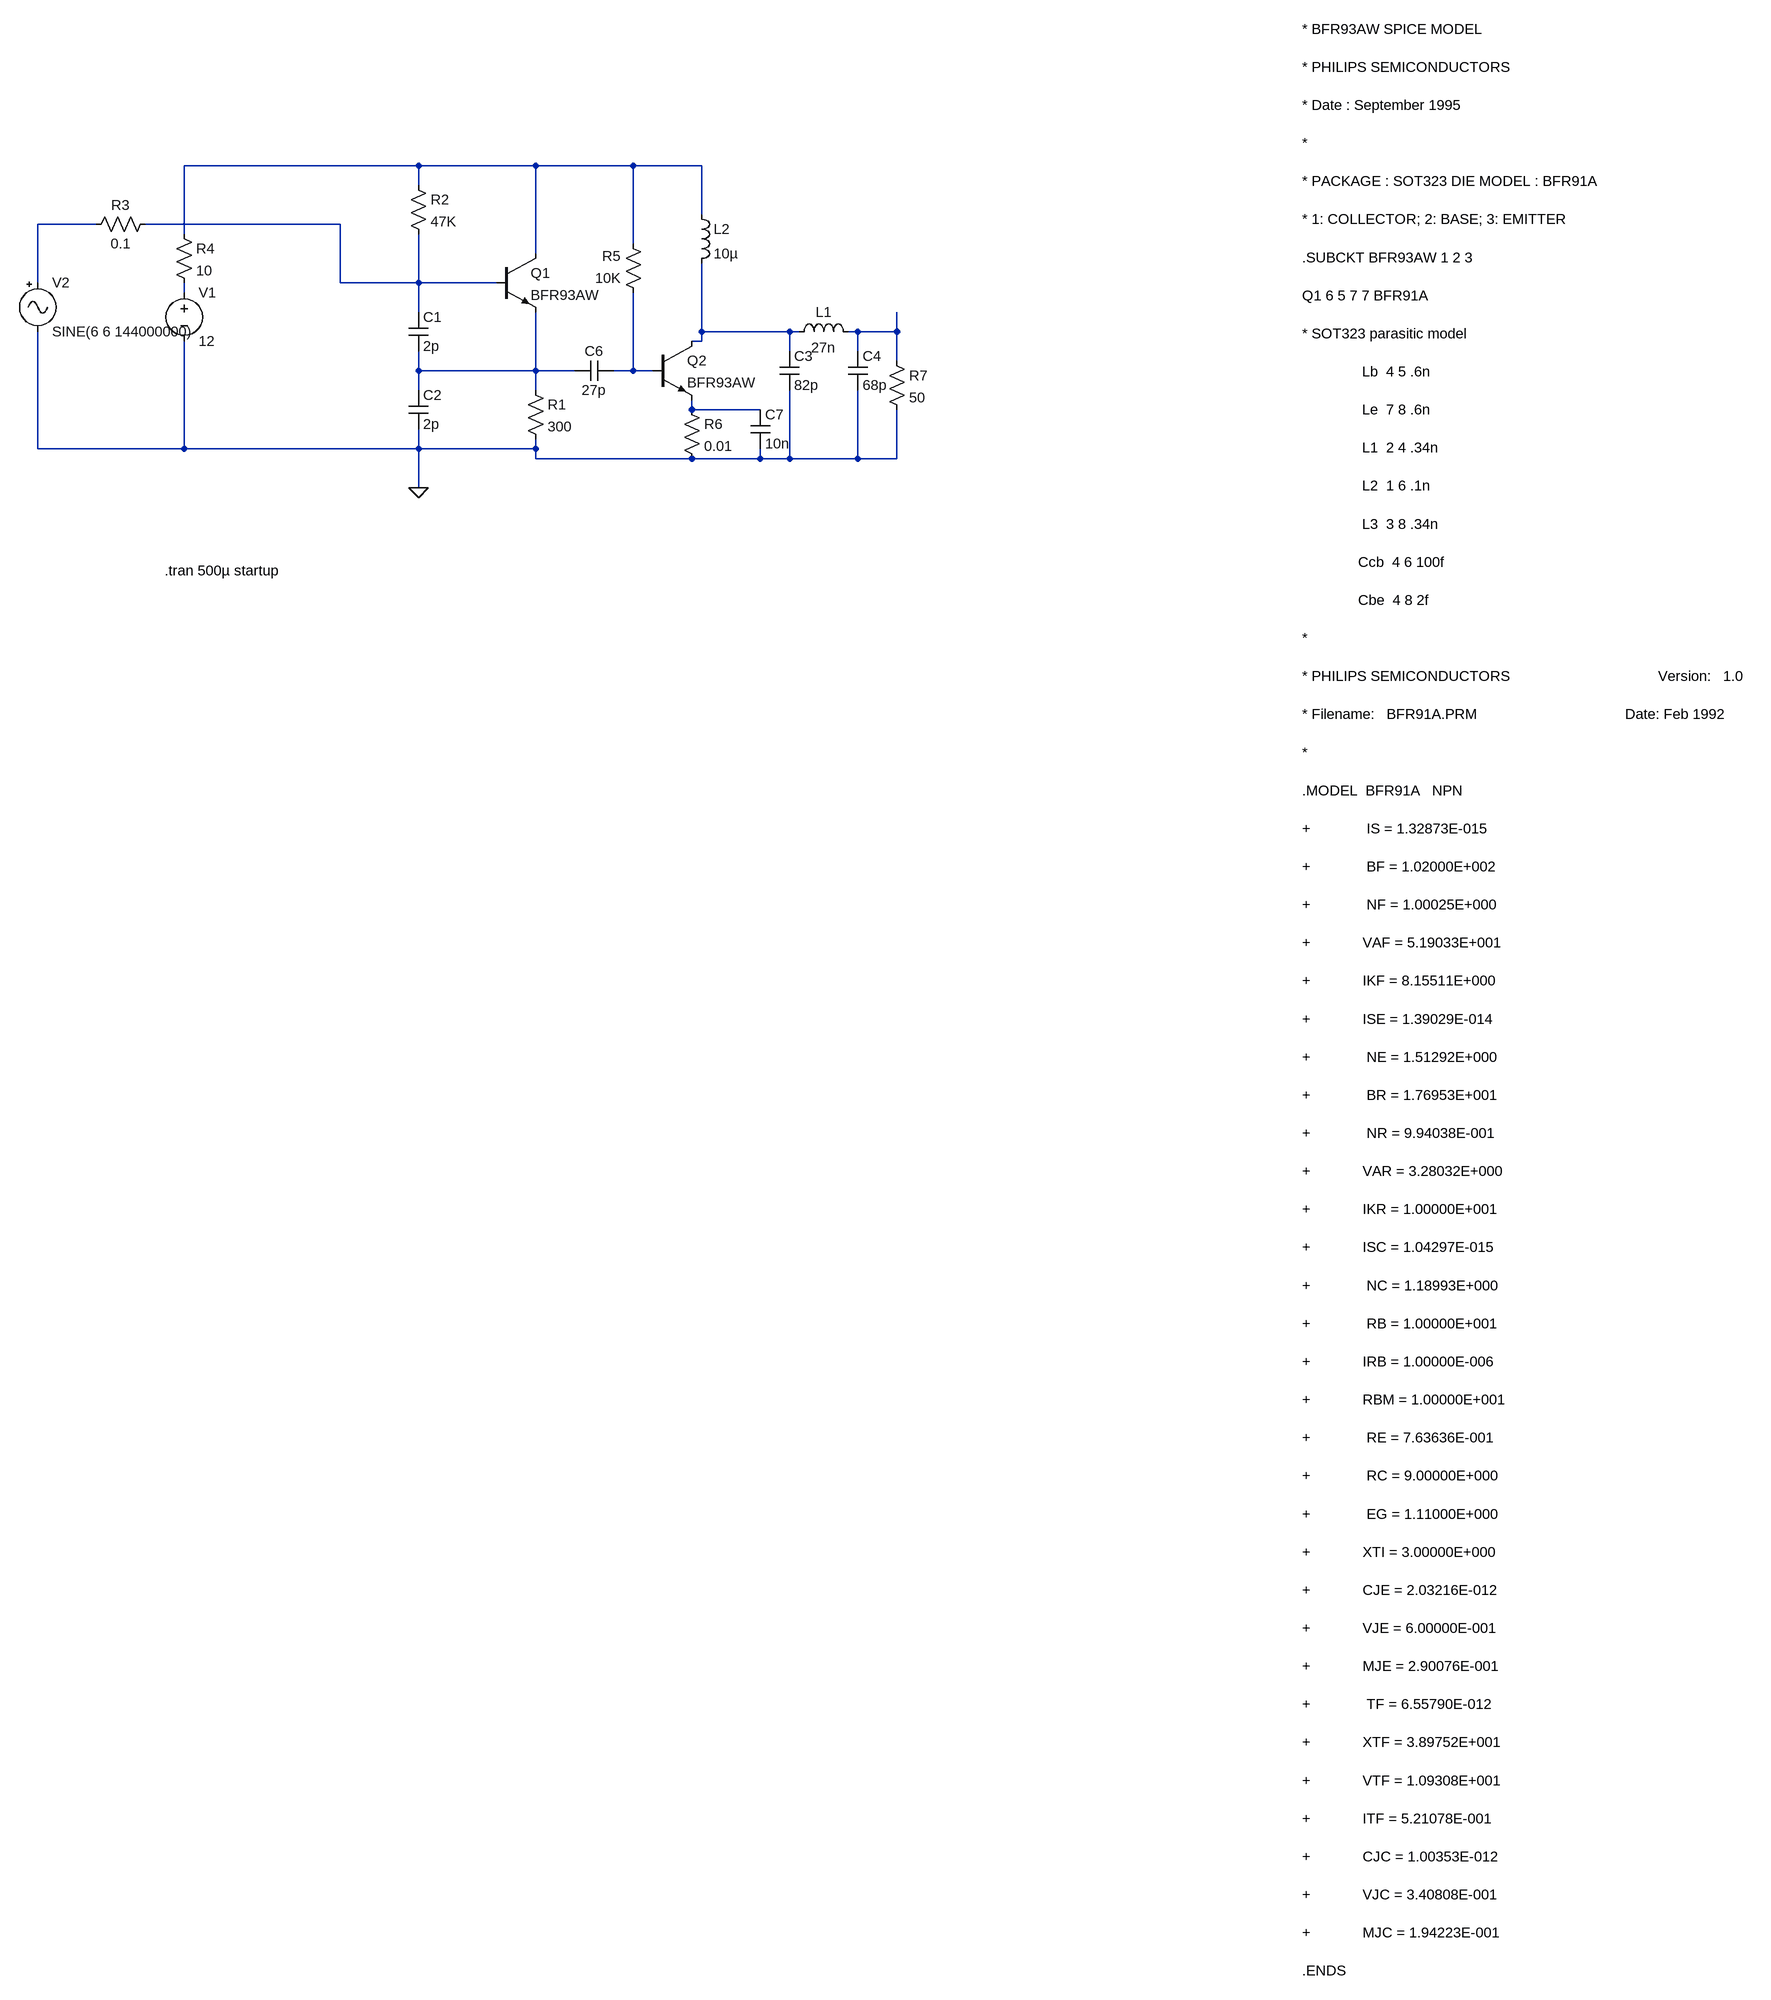
[diagram p0: schematic tx.asc]
tx.asc, the LTspice schematic file:
Version 4
SHEET 1 2536 820
WIRE 240 -688 -144 -688
WIRE 432 -688 240 -688
WIRE 592 -688 432 -688
WIRE 704 -688 592 -688
WIRE 240 -656 240 -688
WIRE 704 -608 704 -688
WIRE -288 -592 -384 -592
WIRE 112 -592 -208 -592
WIRE -144 -576 -144 -688
WIRE 592 -560 592 -688
WIRE 432 -544 432 -688
WIRE -384 -496 -384 -592
WIRE 112 -496 112 -592
WIRE 240 -496 240 -576
WIRE 240 -496 112 -496
WIRE 368 -496 240 -496
WIRE -144 -480 -144 -496
WIRE 240 -448 240 -496
WIRE 704 -416 704 -528
WIRE 848 -416 704 -416
WIRE 864 -416 848 -416
WIRE 960 -416 944 -416
WIRE 1024 -416 1024 -448
WIRE 1024 -416 960 -416
WIRE 704 -400 704 -416
WIRE 704 -400 688 -400
WIRE 848 -384 848 -416
WIRE 960 -384 960 -416
WIRE 1024 -368 1024 -416
WIRE 240 -352 240 -384
WIRE 432 -352 432 -448
WIRE 432 -352 240 -352
WIRE 496 -352 432 -352
WIRE 592 -352 592 -480
WIRE 592 -352 560 -352
WIRE 624 -352 592 -352
WIRE 240 -320 240 -352
WIRE 432 -320 432 -352
WIRE 688 -288 688 -304
WIRE 800 -288 688 -288
WIRE -384 -224 -384 -416
WIRE -144 -224 -144 -400
WIRE -144 -224 -384 -224
WIRE 240 -224 240 -256
WIRE 240 -224 -144 -224
WIRE 432 -224 432 -240
WIRE 432 -224 240 -224
WIRE 432 -208 432 -224
WIRE 688 -208 432 -208
WIRE 800 -208 800 -224
WIRE 800 -208 688 -208
WIRE 848 -208 848 -320
WIRE 848 -208 800 -208
WIRE 960 -208 960 -320
WIRE 960 -208 848 -208
WIRE 1024 -208 1024 -288
WIRE 1024 -208 960 -208
WIRE 240 -160 240 -224
FLAG 240 -160 0
SYMBOL npn 368 -544 R0
SYMATTR InstName Q1
SYMATTR Value BFR93AW
SYMATTR Prefix X
SYMBOL res 416 -336 R0
SYMATTR InstName R1
SYMATTR Value 300
SYMBOL res 224 -672 R0
SYMATTR InstName R2
SYMATTR Value 47K
SYMBOL cap 224 -448 R0
SYMATTR InstName C1
SYMATTR Value 2p
SYMBOL cap 224 -320 R0
SYMATTR InstName C2
SYMATTR Value 2p
SYMBOL voltage -144 -496 R0
WINDOW 123 0 0 Left 2
WINDOW 39 0 0 Left 2
SYMATTR InstName V1
SYMATTR Value 12
SYMBOL Misc\\signal -384 -512 R0
WINDOW 123 0 0 Left 2
WINDOW 39 0 0 Left 2
SYMATTR InstName V2
SYMATTR Value SINE(6 6 144000000)
SYMBOL res -160 -592 R0
SYMATTR InstName R4
SYMATTR Value 10
SYMBOL res -192 -608 R90
WINDOW 0 0 56 VBottom 2
WINDOW 3 32 56 VTop 2
SYMATTR InstName R3
SYMATTR Value 0.1
SYMBOL npn 624 -400 R0
SYMATTR InstName Q2
SYMATTR Value BFR93AW
SYMATTR Prefix X
SYMBOL res 608 -464 R180
WINDOW 0 36 76 Left 2
WINDOW 3 36 40 Left 2
SYMATTR InstName R5
SYMATTR Value 10K
SYMBOL cap 560 -368 R90
WINDOW 0 0 32 VBottom 2
WINDOW 3 32 32 VTop 2
SYMATTR InstName C6
SYMATTR Value 27p
SYMBOL res 672 -304 R0
SYMATTR InstName R6
SYMATTR Value 0.01
SYMBOL cap 784 -288 R0
SYMATTR InstName C7
SYMATTR Value 10n
SYMBOL ind 688 -624 R0
SYMATTR InstName L2
SYMATTR Value 10µ
SYMBOL res 1008 -384 R0
SYMATTR InstName R7
SYMATTR Value 50
SYMBOL cap 832 -384 R0
SYMATTR InstName C3
SYMATTR Value 82p
SYMBOL cap 944 -384 R0
SYMATTR InstName C4
SYMATTR Value 68p
SYMBOL ind 848 -400 R270
WINDOW 0 32 56 VTop 2
WINDOW 3 5 56 VBottom 2
SYMATTR InstName L1
SYMATTR Value 27n
TEXT 1688 -912 Left 2 !* BFR93AW SPICE MODEL\n\n* PHILIPS SEMICONDUCTORS\n\n* Date : September 1995\n\n*\n\n* PACKAGE : SOT323 DIE MODEL : BFR91A\n\n* 1: COLLECTOR; 2: BASE; 3: EMITTER\n\n.SUBCKT BFR93AW 1 2 3\n\nQ1 6 5 7 7 BFR91A\n\n* SOT323 parasitic model\n\n               Lb  4 5 .6n \n\n               Le  7 8 .6n\n\n               L1  2 4 .34n\n\n               L2  1 6 .1n\n\n               L3  3 8 .34n\n\n              Ccb  4 6 100f\n\n              Cbe  4 8 2f\n\n*\n\n* PHILIPS SEMICONDUCTORS                                     Version:   1.0\n\n* Filename:   BFR91A.PRM                                     Date: Feb 1992\n\n*\n\n.MODEL  BFR91A   NPN\n\n+              IS = 1.32873E-015\n\n+              BF = 1.02000E+002\n\n+              NF = 1.00025E+000\n\n+             VAF = 5.19033E+001\n\n+             IKF = 8.15511E+000\n\n+             ISE = 1.39029E-014\n\n+              NE = 1.51292E+000\n\n+              BR = 1.76953E+001\n\n+              NR = 9.94038E-001\n\n+             VAR = 3.28032E+000\n\n+             IKR = 1.00000E+001\n\n+             ISC = 1.04297E-015\n\n+              NC = 1.18993E+000\n\n+              RB = 1.00000E+001\n\n+             IRB = 1.00000E-006\n\n+             RBM = 1.00000E+001\n\n+              RE = 7.63636E-001\n\n+              RC = 9.00000E+000\n\n+              EG = 1.11000E+000\n\n+             XTI = 3.00000E+000\n\n+             CJE = 2.03216E-012\n\n+             VJE = 6.00000E-001\n\n+             MJE = 2.90076E-001\n\n+              TF = 6.55790E-012\n\n+             XTF = 3.89752E+001\n\n+             VTF = 1.09308E+001\n\n+             ITF = 5.21078E-001\n\n+             CJC = 1.00353E-012\n\n+             VJC = 3.40808E-001\n\n+             MJC = 1.94223E-001\n\n.ENDS
TEXT -176 -24 Left 2 !.tran 500µ startup

The netlist it stands for:
* tx.asc
XQ1 N001 N003 N007 BFR93AW  ; pins C B E
R1 N007 0 300
R2 N001 N003 47K
C1 N003 N007 2p
C2 N007 0 2p
V1 N004 0 12
V2 N002 0 SINE(6 6 144000000)
R4 N001 N004 10
R3 N003 N002 0.1
XQ2 N005 N008 N009 BFR93AW  ; pins C B E
R5 N008 N001 10K
C6 N008 N007 27p
R6 N009 0 0.01
C7 N009 0 10n
L2 N001 N005 10µ
R7 N006 0 50
C3 N005 0 82p
C4 N006 0 68p
L1 N005 N006 27n
* BFR93AW SPICE MODEL
* PHILIPS SEMICONDUCTORS
* Date : September 1995
*
* PACKAGE : SOT323 DIE MODEL : BFR91A
* 1: COLLECTOR; 2: BASE; 3: EMITTER
.SUBCKT BFR93AW 1 2 3
Q1 6 5 7 7 BFR91A
* SOT323 parasitic model
               Lb  4 5 .6n
               Le  7 8 .6n
               L1  2 4 .34n
               L2  1 6 .1n
               L3  3 8 .34n
              Ccb  4 6 100f
              Cbe  4 8 2f
*
* PHILIPS SEMICONDUCTORS                                     Version:   1.0
* Filename:   BFR91A.PRM                                     Date: Feb 1992
*
.MODEL  BFR91A   NPN
+              IS = 1.32873E-015
+              BF = 1.02000E+002
+              NF = 1.00025E+000
+             VAF = 5.19033E+001
+             IKF = 8.15511E+000
+             ISE = 1.39029E-014
+              NE = 1.51292E+000
+              BR = 1.76953E+001
+              NR = 9.94038E-001
+             VAR = 3.28032E+000
+             IKR = 1.00000E+001
+             ISC = 1.04297E-015
+              NC = 1.18993E+000
+              RB = 1.00000E+001
+             IRB = 1.00000E-006
+             RBM = 1.00000E+001
+              RE = 7.63636E-001
+              RC = 9.00000E+000
+              EG = 1.11000E+000
+             XTI = 3.00000E+000
+             CJE = 2.03216E-012
+             VJE = 6.00000E-001
+             MJE = 2.90076E-001
+              TF = 6.55790E-012
+             XTF = 3.89752E+001
+             VTF = 1.09308E+001
+             ITF = 5.21078E-001
+             CJC = 1.00353E-012
+             VJC = 3.40808E-001
+             MJC = 1.94223E-001
.ENDS
.tran 500µ startup
.backanno
.end